# EAGLE design webcam (EAGLE 8.6.1)
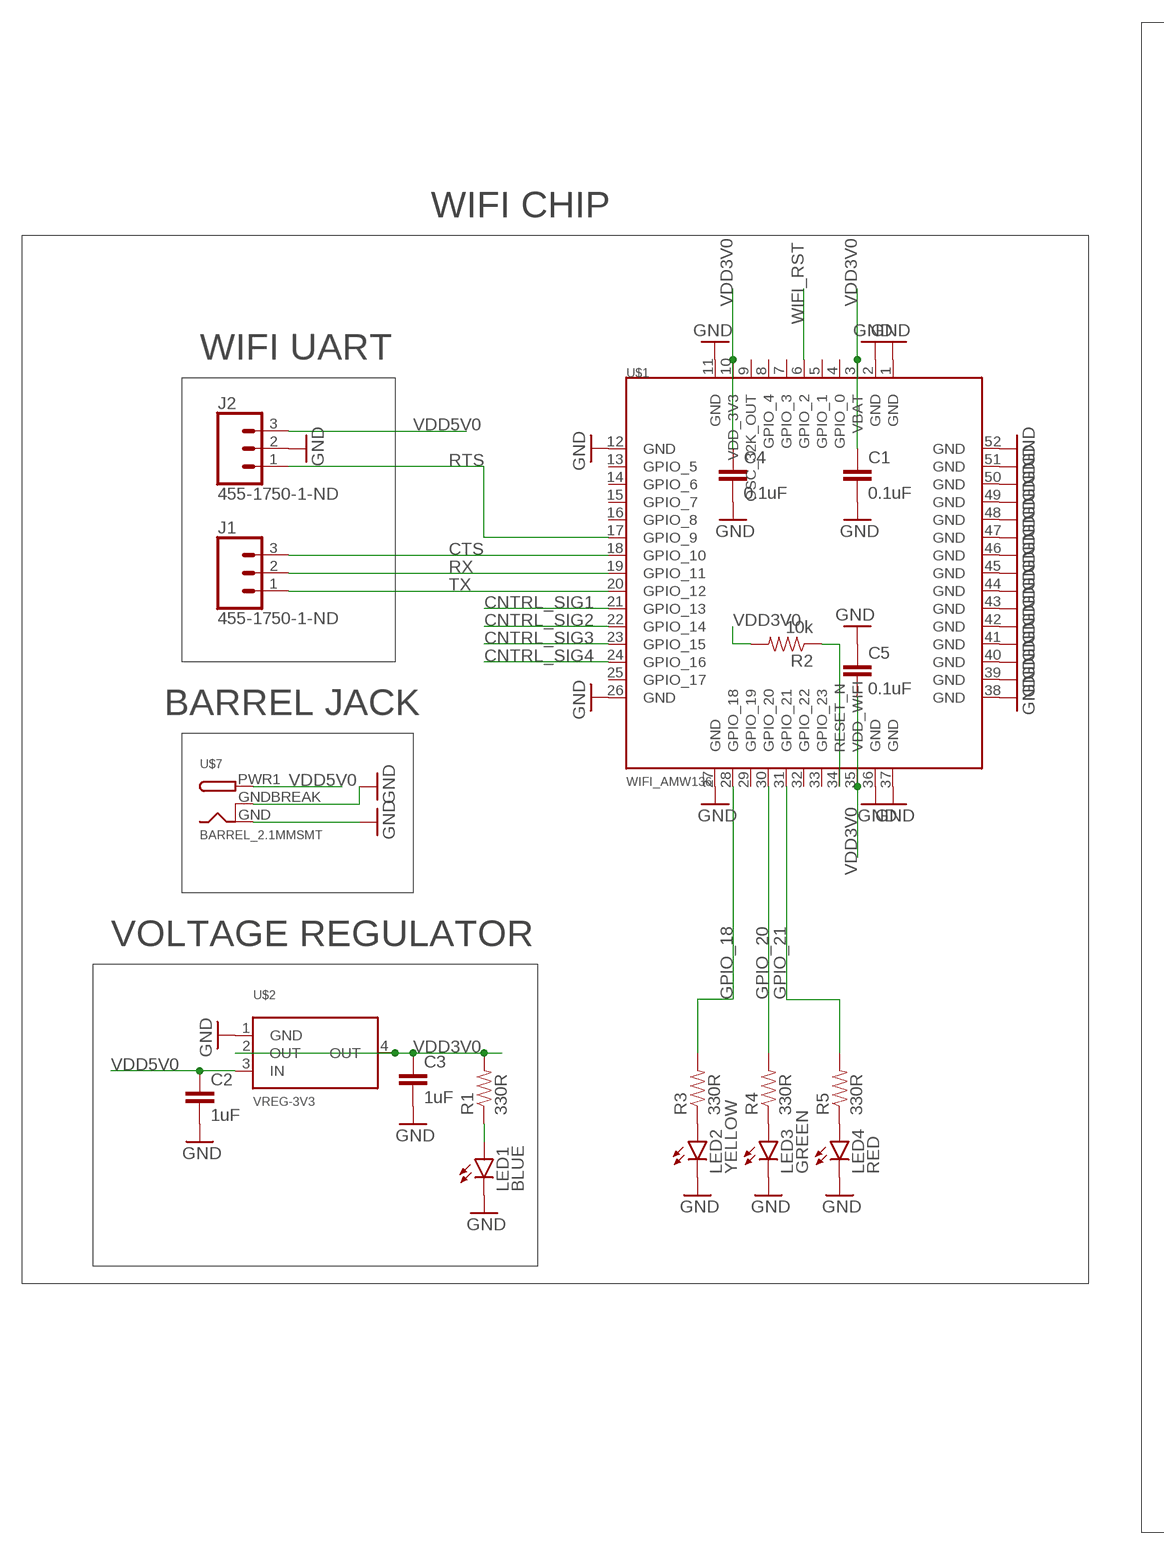
[diagram p0: schematic, sheet 1, part 1 of 2]
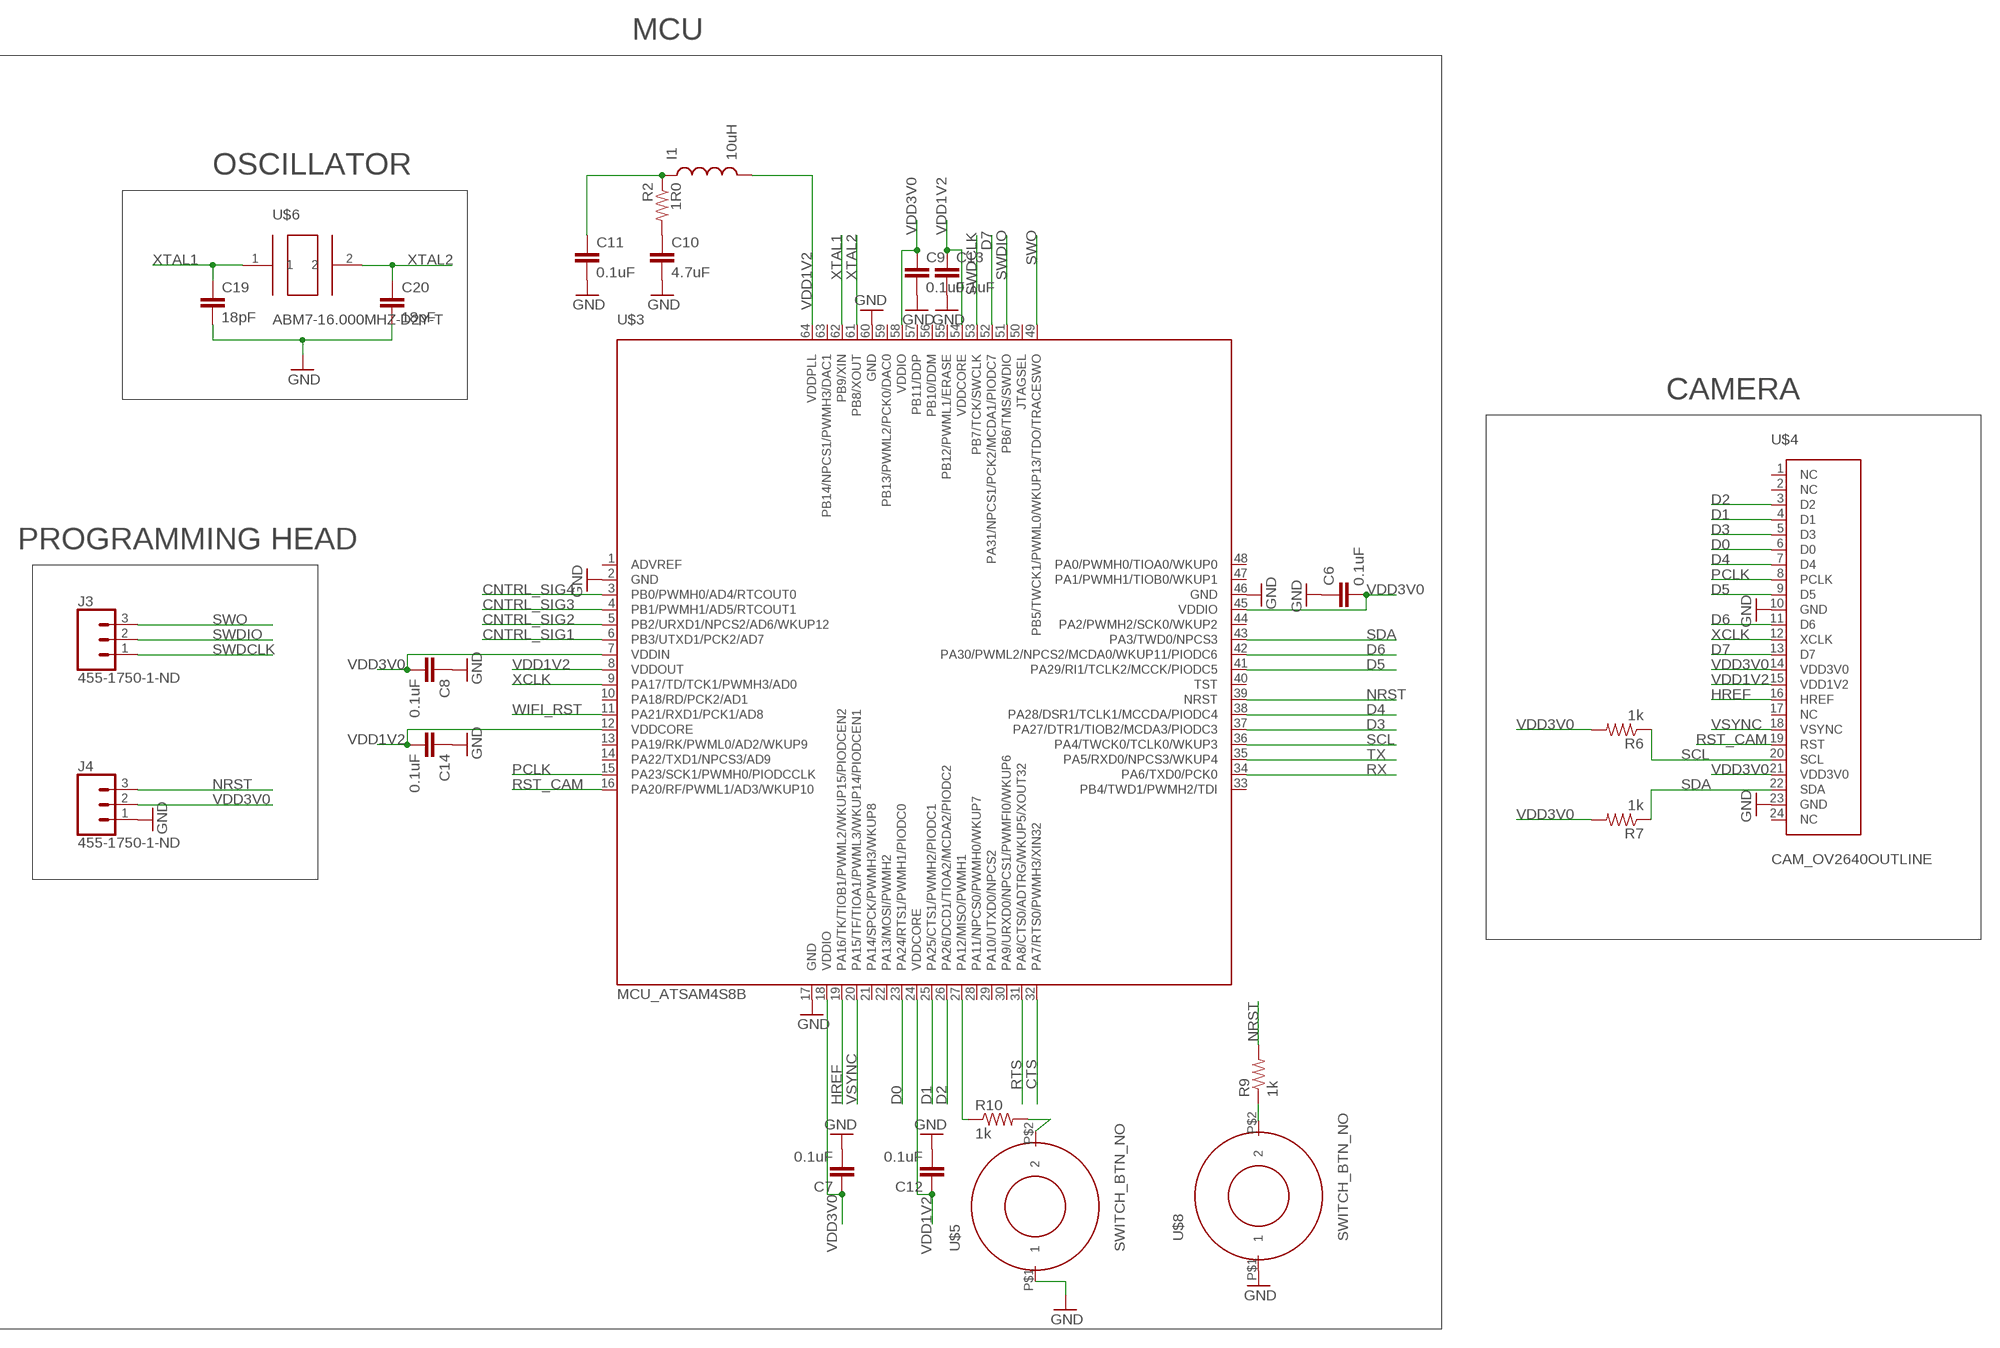
[diagram p1: schematic, sheet 1, part 2 of 2]

## Parts
1R0  R2  RES  [0805]
C1  0.1uF  CAP  [0805]
C2  1uF  CAP  [0805]
C3  1uF  CAP  [0805]
C4  0.1uF  CAP  [0805]
C5  0.1uF  CAP  [0805]
C6  0.1uF  CAP  [0805]
C7  0.1uF  CAP  [0805]
C8  0.1uF  CAP  [0805]
C9  0.1uF  CAP  [0805]
C10  4.7uF  CAP  [0805]
C11  0.1uF  CAP  [0805]
C12  0.1uF  CAP  [0805]
C13  0.1uF  CAP  [0805]
C14  0.1uF  CAP  [0805]
C19  18pF  CAP0805  [0805]
C20  18pF  CAP0805  [0805]
I1  10uH  IND  [0805]
J1  455-1750-1-ND  CONN_03  [1X03]
J2  455-1750-1-ND  CONN_03  [1X03]
J3  455-1750-1-ND  CONN_03  [1X03]
J4  455-1750-1-ND  CONN_03  [1X03]
LED1  BLUE  LED0603  [LED-0603]
LED2  YELLOW  LED0603  [LED-0603]
LED3  GREEN  LED0603  [LED-0603]
LED4  RED  LED0603  [LED-0603]
R1  330R  RES  [0805]
R2  10k  RES  [0805]
R3  330R  RES  [0805]
R4  330R  RES  [0805]
R5  330R  RES  [0805]
R6  1k  RES  [0805]
R7  1k  RES  [0805]
R9  1k  RES  [0805]
R10  1k  RES  [0805]
U$1  WIFI_AMW136  [AMW136]
U$2  VREG-3V3  [R-PDSO-G4_TI]
U$3  MCU_ATSAM4S8B  [QFP50P1200X1200X160-64N]
U$4  CAM_OV2640OUTLINE  [CAM_CONN]
U$5  SWITCH_BTN_NO  [BTN_2]
U$6  ABM7-16.000MHZ-D2Y-T  [ABM7-16.000MHZ-D2Y-T]
U$7  BARREL_2.1MMSMT  [DCJACK_2MM_SMT]
U$8  SWITCH_BTN_NO  [BTN_2]

## Nets
CNTRL_SIG1: U$1.21(GPIO_13) U$3.6(PB3/UTXD1/PCK2/AD7)
CNTRL_SIG2: U$1.22(GPIO_14) U$3.5(PB2/URXD1/NPCS2/AD6/WKUP12)
CNTRL_SIG3: U$1.23(GPIO_15) U$3.4(PB1/PWMH1/AD5/RTCOUT1)
CNTRL_SIG4: U$1.24(GPIO_16) U$3.3(PB0/PWMH0/AD4/RTCOUT0)
CTS: J1.3 U$1.18(GPIO_10) U$3.32(PA7/RTS0/PWMH3/XIN32)
D0: U$3.23(PA24/RTS1/PWMH1/PIODC0) U$4.6(D0)
D1: U$3.25(PA25/CTS1/PWMH2/PIODC1) U$4.4(D1)
D2: U$3.26(PA26/DCD1/TIOA2/MCDA2/PIODC2) U$4.3(D2)
D3: U$3.37(PA27/DTR1/TIOB2/MCDA3/PIODC3) U$4.5(D3)
D4: U$3.38(PA28/DSR1/TCLK1/MCCDA/PIODC4) U$4.7(D4)
D5: U$3.41(PA29/RI1/TCLK2/MCCK/PIODC5) U$4.9(D5)
D6: U$3.42(PA30/PWML2/NPCS2/MCDA0/WKUP11/PIODC6) U$4.11(D6)
D7: U$3.52(PA31/NPCS1/PCK2/MCDA1/PIODC7) U$4.13(D7)
GND: C1.2 C2.2 C3.2 C4.2 C5.1 C6.1 C7.2 C8.1 C9.2 C10.2 C11.2 C12.2 C13.2 C14.1 C19.2 C20.2 J2.2 J4.1 LED1.C LED2.C LED3.C LED4.C U$1.1(GND) U$1.2(GND) U$1.11(GND) U$1.12(GND) U$1.26(GND) U$1.27(GND) U$1.36(GND) U$1.37(GND) U$1.38(GND) U$1.39(GND) U$1.40(GND) U$1.41(GND) U$1.42(GND) U$1.43(GND) U$1.44(GND) U$1.45(GND) U$1.46(GND) U$1.47(GND) U$1.48(GND) U$1.49(GND) U$1.50(GND) U$1.51(GND) U$1.52(GND) U$2.1(GND) U$3.2(GND) U$3.17(GND) U$3.46(GND) U$3.60(GND) U$4.10(GND) U$4.23(GND) U$5.P$1 U$7.GND U$7.GNDBREAK U$8.P$1
GPIO_18: R3.2 U$1.28(GPIO_18)
GPIO_20: R4.2 U$1.30(GPIO_20)
GPIO_21: R5.2 U$1.31(GPIO_21)
HREF: U$3.19(PA16/TK/TIOB1/PWML2/WKUP15/PIODCEN2) U$4.16(HREF)
N$1: LED1.A R1.1
N$2: 1R0.2 C10.1
N$3: 1R0.1 C11.1 I1.1
N$6: R10.1 U$3.27(PA12/MISO/PWMH1)
N$7: R10.2 U$5.P$2
N$8: R9.1 U$8.P$2
N$13: LED2.A R3.1
N$14: LED3.A R4.1
N$15: LED4.A R5.1
N$21: R2.1 U$1.34(RESET_N)
NRST: J4.3 R9.2 U$3.39(NRST)
PCLK: U$3.15(PA23/SCK1/PWMH0/PIODCCLK) U$4.8(PCLK)
RST_CAM: U$3.16(PA20/RF/PWML1/AD3/WKUP10) U$4.19(RST)
RTS: J2.1 U$1.17(GPIO_9) U$3.31(PA8/CTS0/ADTRG/WKUP5/XOUT32)
RX: J1.2 U$1.19(GPIO_11) U$3.34(PA6/TXD0/PCK0)
SCL: R6.1 U$3.36(PA4/TWCK0/TCLK0/WKUP3) U$4.20(SCL)
SDA: R7.1 U$3.43(PA3/TWD0/NPCS3) U$4.22(SDA)
SWDCLK: J3.1 U$3.53(PB7/TCK/SWCLK)
SWDIO: J3.2 U$3.51(PB6/TMS/SWDIO)
SWO: J3.3 U$3.49(PB5/TWCK1/PWML0/WKUP13/TDO/TRACESWO)
TX: J1.1 U$1.20(GPIO_12) U$3.35(PA5/RXD0/NPCS3/WKUP4)
VDD1V2: C12.1 C13.1 C14.2 I1.2 U$3.8(VDDOUT) U$3.12(VDDCORE) U$3.24(VDDCORE) U$3.54(VDDCORE) U$3.64(VDDPLL) U$4.15(VDD1V2)
VDD3V0: C1.1 C3.1 C4.1 C5.2 C6.2 C7.1 C8.2 C9.1 J4.2 R1.2 R2.2 R6.2 R7.2 U$1.3(VBAT) U$1.10(VDD_3V3) U$1.35(VDD_WIFI) U$2.2(OUT) U$2.4(OUT) U$3.7(VDDIN) U$3.18(VDDIO) U$3.45(VDDIO) U$3.58(VDDIO) U$4.14(VDD3V0) U$4.21(VDD3V0)
VDD5V0: C2.1 J2.3 U$2.3(IN) U$7.PWR1(PWR)
VSYNC: U$3.20(PA15/TF/TIOA1/PWML3/WKUP14/PIODCEN1) U$4.18(VSYNC)
WIFI_RST: U$1.6(GPIO_2) U$3.11(PA21/RXD1/PCK1/AD8)
XCLK: U$3.9(PA17/TD/TCK1/PWMH3/AD0) U$4.12(XCLK)
XTAL1: C19.1 U$3.62(PB9/XIN) U$6.1
XTAL2: C20.1 U$3.61(PB8/XOUT) U$6.2
Unconnected: U$1.4(GPIO_0) U$1.5(GPIO_1) U$1.7(GPIO_3) U$1.8(GPIO_4) U$1.9(OSC_32K_OUT) U$1.13(GPIO_5) U$1.14(GPIO_6) U$1.15(GPIO_7) U$1.16(GPIO_8) U$1.25(GPIO_17) U$1.29(GPIO_19) U$1.32(GPIO_22) U$1.33(GPIO_23) U$3.1(ADVREF) U$3.10(PA18/RD/PCK2/AD1) U$3.13(PA19/RK/PWML0/AD2/WKUP9) U$3.14(PA22/TXD1/NPCS3/AD9) U$3.21(PA14/SPCK/PWMH3/WKUP8) U$3.22(PA13/MOSI/PWMH2) U$3.28(PA11/NPCS0/PWMH0/WKUP7) U$3.29(PA10/UTXD0/NPCS2) U$3.30(PA9/URXD0/NPCS1/PWMFI0/WKUP6) U$3.33(PB4/TWD1/PWMH2/TDI) U$3.40(TST) U$3.44(PA2/PWMH2/SCK0/WKUP2) U$3.47(PA1/PWMH1/TIOB0/WKUP1) U$3.48(PA0/PWMH0/TIOA0/WKUP0) U$3.50(JTAGSEL) U$3.55(PB12/PWML1/ERASE) U$3.56(PB10/DDM) U$3.57(PB11/DDP) U$3.59(PB13/PWML2/PCK0/DAC0) U$3.63(PB14/NPCS1/PWMH3/DAC1) U$4.1(NC) U$4.2(NC) U$4.17(NC) U$4.24(NC)

## Notes on the sheet
- MCU
- OSCILLATOR
- WIFI CHIP
- WIFI UART
- CAMERA
- PROGRAMMING HEAD
- BARREL JACK
- VOLTAGE REGULATOR

## Library data of the parts
1R0 R1-R7 R9 R10 = Ilya_Teach:RES
C1-C14 = Ilya_Teach:CAP
C19 C20 = SparkFun:CAP: Capacitor Standard 0603 ceramic capacitor, and 0.1" leaded capacitor.
I1 = Ilya_Teach:IND; SPICEPREFIX: I
J1-J4 = SparkFun-Connectors:CONN_03: Multi connection point. Often used as Generic Header-pin footprint for 0.1 inch spaced/style header connections On any of the 0.1 inch spaced packages, you can populate with these: Break Away Headers - Straight <https://www.sparkfun.com/products/116> (PRT-00116) Break Away Male Headers - Right Angle <https://www.sparkfun.com/products/553> (PRT-00553) Female Headers <https://www.sparkfun.com/products/115> (PRT-00115) Break Away Headers - Machine Pin <https://www.sparkfun.com/products/117> (PRT-00117) Break Away Female Headers - Swiss Machine Pin <https://www.sparkfun.com/products/743> (PRT-00743) Stackable Header - 3 Pin (Female, 0.1") <https://www.sparkfun.com/products/13875> (PRT-13875) For SCREWTERMINALS and SPRING TERMINALS visit here: Screw Terimnals on SparkFun.com <https://www.sparkfun.com/search/results?term=Screw+Terminals> (5mm/3.5mm/2.54mm spacing) This device is also useful as a general connection point to wire up your design to another part of your project. Our various solder wires solder well into these plated through hole pads. Hook-Up Wire - Assortment (Stranded, 22 AWG) <https://www.sparkfun.com/products/11375> (PRT-11375) Hook-Up Wire - Assortment (Solid Core, 22 AWG) <https://www.sparkfun.com/products/11367> (PRT-11367) View the entire wire category on our website here <https://www.sparkfun.com/categories/141> Special notes: Molex polarized connector foot print use with SKU : PRT-08232 with associated crimp pins and housings.; PROD_ID: XXX-00000
LED1-LED4 = Ilya_Teach:LED: LEDs Standard schematic elements and footprints for 5mm, 3mm, 1206, and 0603 sized LEDs. 5mm - Spark Fun Electronics SKU : COM-00529 (and others)
U$1 = Ilya_Teach:WIFI_AMW136
U$2 = Ilya_Teach:VREG-3V3
U$3 = Ilya_Teach:MCU_ATSAM4S8B
U$4 = Ilya_Teach:CAM_OV2640
U$5 U$8 = Ilya_Teach:SWITCH_BTN_NO
U$6 = Ilya:ABM7-16.000MHZ-D2Y-T
U$7 = Ilya_Teach:BARREL_2.1MM

## Board
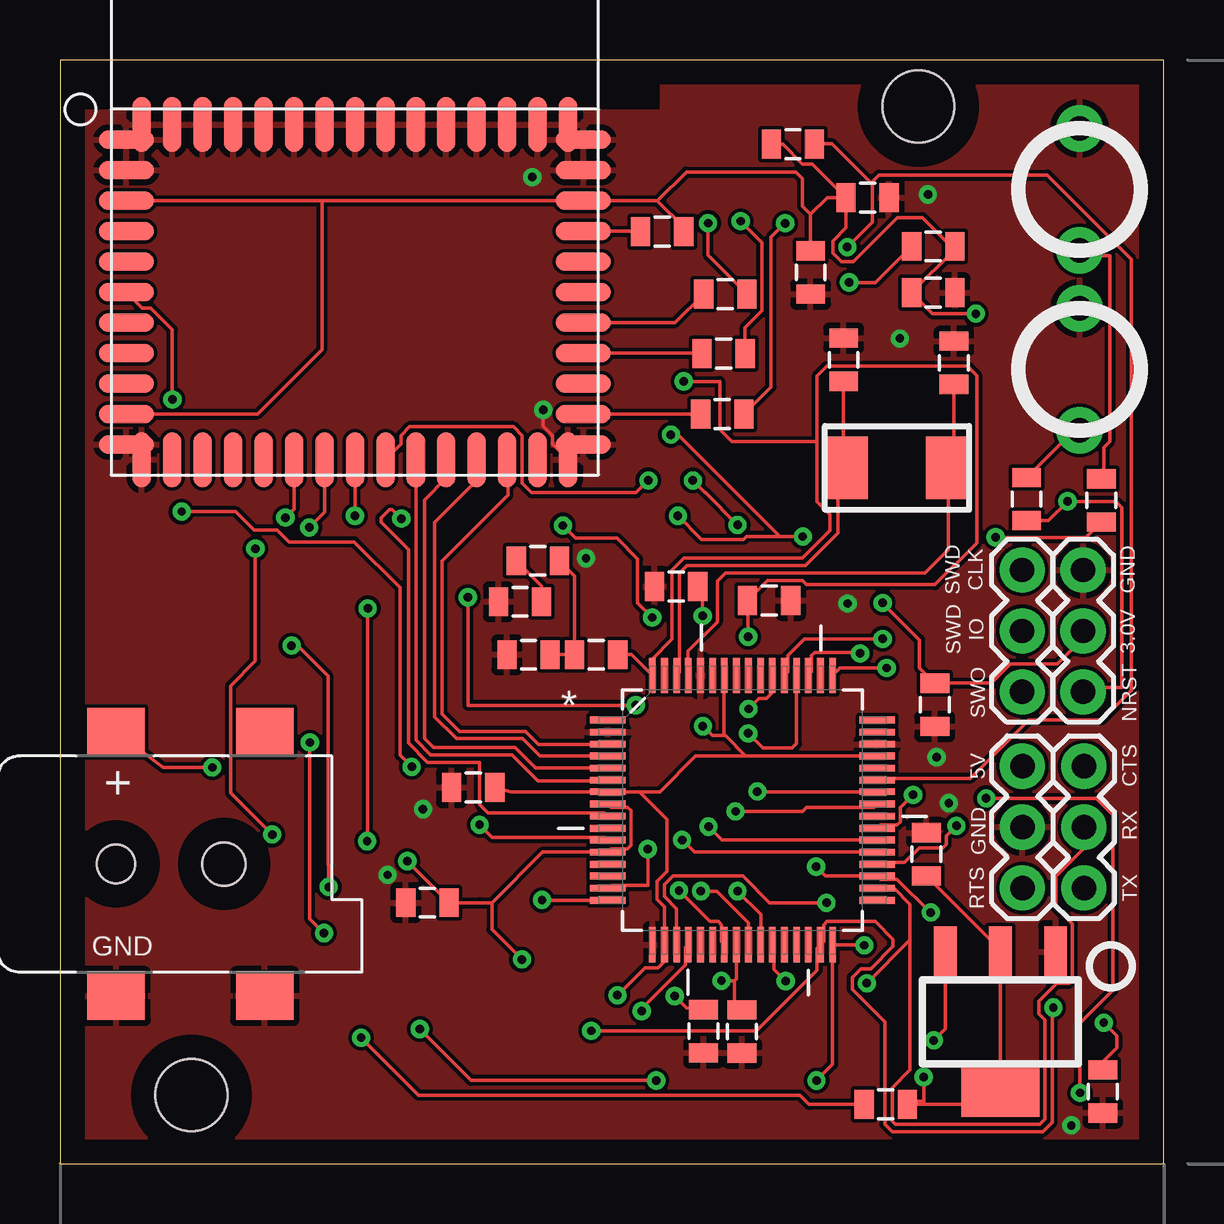
[diagram p2: board, top side]
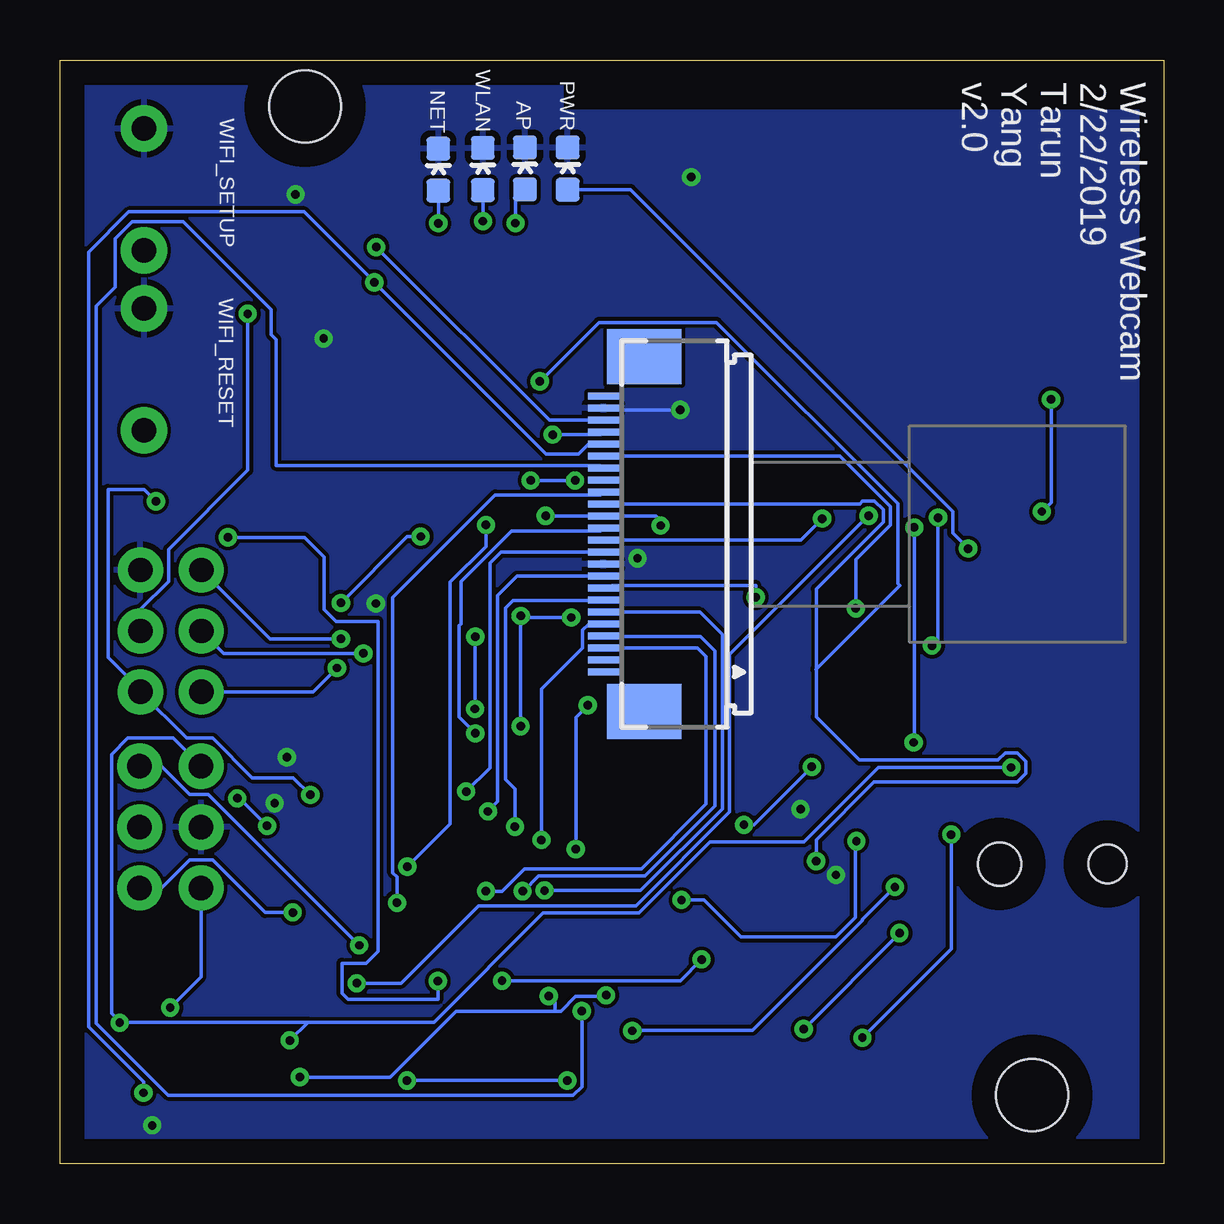
[diagram p3: board, bottom side, seen from below]

Size 46 x 46 mm. Coordinates in mm from the lower left corner, seen from the top.
Outline: 0,0 46,0 46,46 0,46 0,0
Copper layers (1*16): Top 0.035mm / dielectric 1.5mm / Bottom 0.035mm
Design rules "default": minimum track width 6mil, minimum drill 0.35mm, track to track 6mil, track to pad 6mil, pad to pad 6mil, via to via 6mil, smd to smd 6mil, copper to edge 40mil, drill to drill 6mil, minimum pad ring 10mil, minimum via ring 8mil, stop-mask expansion 4mil, vias tented up to drill 0mil, thermal gap 10mil
Holes 3 mm at 5.48,2.85 35.78,44.06

### Footprints (pad centres in the part's own frame; a part is rotated, then mirrored left to right if it is on the bottom)
0805 = smd 0.8 x 1.2: 1 -0.9,0; 2 0.9,0
1X03 = drill 1.016 pad 1.88: 1 0,0; 2 2.54,0; 3 5.08,0
LED-0603 = smd 1 x 1: A 0,-0.877; C 0,0.877
AMW136 = smd 0.762 x 2.286: 1 6.35,9.525; 2 5.08,9.525; 3 3.81,9.525; 4 2.54,9.525; 5 1.27,9.525; 6 0,9.525; 7 -1.27,9.525; 8 -2.54,9.525; 9 -3.81,9.525; 10 -5.08,9.525; 11 -6.35,9.525; 27 -6.35,-9.525; 28 -5.08,-9.525; 29 -3.81,-9.525; 30 -2.54,-9.525; 31 -1.27,-9.525; 32 0,-9.525; 33 1.27,-9.525; 34 2.54,-9.525; 35 3.81,-9.525; 36 5.08,-9.525; 37 6.35,-9.525 | smd 2.286 x 0.762: 12 -6.985,8.89; 13 -6.985,7.62; 14 -6.985,6.35; 15 -6.985,5.08; 16 -6.985,3.81; 17 -6.985,2.54; 18 -6.985,1.27; 19 -6.985,0; 20 -6.985,-1.27; 21 -6.985,-2.54; 22 -6.985,-3.81; 23 -6.985,-5.08; 24 -6.985,-6.35; 25 -6.985,-7.62; 26 -6.985,-8.89; 38 6.985,-8.89; 39 6.985,-7.62; 40 6.985,-6.35; 41 6.985,-5.08; 42 6.985,-3.81; 43 6.985,-2.54; 44 6.985,-1.27; 45 6.985,0; 46 6.985,1.27; 47 6.985,2.54; 48 6.985,3.81; 49 6.985,5.08; 50 6.985,6.35; 51 6.985,7.62; 52 6.985,8.89
R-PDSO-G4_TI = smd 0.95 x 2.15: 1 -2.3,-2.9; 2 0,-2.9; 3 2.3,-2.9 | smd 3.25 x 2.15: 4 0,2.9
QFP50P1200X1200X160-64N = smd 1.473 x 0.279: 1 -5.613,3.759; 2 -5.613,3.251; 3 -5.613,2.743; 4 -5.613,2.261; 5 -5.613,1.753; 6 -5.613,1.245; 7 -5.613,0.762; 8 -5.613,0.254; 9 -5.613,-0.254; 10 -5.613,-0.762; 11 -5.613,-1.245; 12 -5.613,-1.753; 13 -5.613,-2.261; 14 -5.613,-2.743; 15 -5.613,-3.251; 16 -5.613,-3.759; 33 5.613,-3.759; 34 5.613,-3.251; 35 5.613,-2.743; 36 5.613,-2.261; 37 5.613,-1.753; 38 5.613,-1.245; 39 5.613,-0.762; 40 5.613,-0.254; 41 5.613,0.254; 42 5.613,0.762; 43 5.613,1.245; 44 5.613,1.753; 45 5.613,2.261; 46 5.613,2.743; 47 5.613,3.251; 48 5.613,3.759 | smd 0.279 x 1.473: 17 -3.759,-5.613; 18 -3.251,-5.613; 19 -2.743,-5.613; 20 -2.261,-5.613; 21 -1.753,-5.613; 22 -1.245,-5.613; 23 -0.762,-5.613; 24 -0.254,-5.613; 25 0.254,-5.613; 26 0.762,-5.613; 27 1.245,-5.613; 28 1.753,-5.613; 29 2.261,-5.613; 30 2.743,-5.613; 31 3.251,-5.613; 32 3.759,-5.613; 49 3.759,5.613; 50 3.251,5.613; 51 2.743,5.613; 52 2.261,5.613; 53 1.753,5.613; 54 1.245,5.613; 55 0.762,5.613; 56 0.254,5.613; 57 -0.254,5.613; 58 -0.762,5.613; 59 -1.245,5.613; 60 -1.753,5.613; 61 -2.261,5.613; 62 -2.743,5.613; 63 -3.251,5.613; 64 -3.759,5.613
CAM_CONN = smd 0.3 x 1.3: 1 -5.75,3.25; 2 -5.25,3.25; 3 -4.75,3.25; 4 -4.25,3.25; 5 -3.75,3.25; 6 -3.25,3.25; 7 -2.75,3.25; 8 -2.25,3.25; 9 -1.75,3.25; 10 -1.25,3.25; 11 -0.75,3.25; 12 -0.25,3.25; 13 0.25,3.25; 14 0.75,3.25; 15 1.25,3.25; 16 1.75,3.25; 17 2.25,3.25; 18 2.75,3.25; 19 3.25,3.25; 20 3.75,3.25; 21 4.25,3.25; 22 4.75,3.25; 23 5.25,3.25; 24 5.75,3.25 | smd 2.3 x 3.1: P1 -7.4,1.55; P2 7.4,1.55
BTN_2 = drill 1.016 pad 1.93: P$1 -2.54,0; P$2 2.54,0
ABM7-16.000MHZ-D2Y-T = smd 1.9 x 2.6: 1 -2.15,0; 2 2.15,0
DCJACK_2MM_SMT = smd 2.4 x 2: GND -2.54,-5.5; GNDBREAK 3.66,-5.5; PWR1 -2.54,5.5; PWR2 3.66,5.5 | hole 1.6: -2.54,0 | hole 1.8: 1.96,0

### Placement (x,y rotation side)
1R0  19.92,25.13 180 top
C1  36.46,19.12 270 top
C2  43.46,3.01 270 top
C3  26.82,5.51 270 top
C4  17.22,15.67 180 top
C5  31.29,37.14 90 top
C6  25.68,24.05 0 top
C7  36.12,12.89 90 top
C8  36.4,36.3 180 top
C9  33.66,40.26 0 top
C10  19.18,23.42 180 top
C11  19.53,21.21 180 top
C12  28.43,5.51 270 top
C13  15.32,10.87 180 top
C14  29.56,23.47 180 top
C19  32.66,33.5 90 top
C20  37.26,33.38 90 top
I1  22.35,21.21 0 top
J1  42.68,11.48 90 top
J2  40.12,11.48 90 top
J3  40.11,24.74 270 top
J4  42.65,24.74 270 top
LED1  24.84,41.47 0 bottom
LED2  30.23,41.43 0 bottom
LED3  28.37,41.45 0 bottom
LED4  26.62,41.48 0 bottom
R1  34.42,2.46 0 top
R2  25.1,38.85 0 top
R3  27.61,31.24 180 top
R4  27.66,33.76 180 top
R5  27.74,36.25 180 top
R6  36.4,38.23 0 top
R7  30.55,42.49 180 top
R9  40.29,27.7 270 top
R10  43.41,27.64 90 top
U$1  12.29,36.32 90 top
U$2  39.2,5.91 180 top
U$3  28.45,14.73 0 top
U$4  20.09,26.24 90 bottom
U$5  42.5,40.6 270 top
U$6  34.89,29 0 top
U$7  4.87,12.48 0 top
U$8  42.5,33.1 270 top

### Tracks (layer width: path | path; a pad name or v marks a point on that pad's centre or on a via)
CNTRL_SIG1
  Top 0.152: U$3.6 22.81,15.95 19.93,15.95 18.84,17.03 15.45,17.03 14.83,17.65 U$1.21
CNTRL_SIG2
  Top 0.152: U$1.22 16.1,28.57 15.19,27.66 15.19,17.73 15.58,17.34 18.97,17.34 19.82,16.48 U$3.5
CNTRL_SIG3
  Top 0.152: U$3.4 20,16.99 19.29,17.71 16.53,17.71 15.62,18.62 15.62,26.72 17.37,28.47 U$1.23
CNTRL_SIG4
  Top 0.152: U$3.3 19.95,17.48 19.41,18.01 16.66,18.01 15.93,18.74 15.93,25.12 18.67,27.86 18.67,29.31 U$1.24
CTS  (via drill 0.35)
  Top 0.152: U$1.18 11.02,27.15 v10.39,26.52 | v33.53,9.09 33.5,9.12 U$3.32 32.21,4.13 v31.54,3.46 | v15,5.6 17.14,3.46 v24.86,3.46 | v11.01,9.6 10.41,10.2 v10.41,17.55
  Bottom 0.152: v10.39,26.52 10.39,17.58 v10.41,17.55 | v33.53,9.09 39.83,15.39 40.6,15.39 41.77,16.56 J1.3 | v31.54,3.46 v24.86,3.46 | v15,5.6 v11.01,9.6
D0  (via drill 0.35)
  Top 0.152: U$3.23 27.57,9.23 27.57,9.95 27.44,10.08 27.1,10.08 v25.8,11.38
  Bottom 0.152: v25.8,11.38 21.79,11.38 18.39,14.78 18.39,22.05 19.33,22.99 U$4.6
D1  (via drill 0.35)
  Top 0.152: U$3.25 28.7,10.03 27.38,11.35 v26.71,11.35
  Bottom 0.152: v26.71,11.35 26.69,11.35 26.05,11.99 21.62,11.99 18.69,14.91 18.69,21.36 19.3,21.97 23.32,21.97 U$4.4
D2  (via drill 0.35)
  Top 0.152: U$3.26 29.21,10.38 v28.24,11.35
  Bottom 0.152: v28.24,11.35 27.57,11.35 26.63,12.29 21.77,12.29 19.07,14.99 19.07,21.13 19.43,21.49 U$4.3 | U$4.3
D3  (via drill 0.35)
  Top 0.152: U$3.37 26.44,12.98 v25.93,13.49
  Bottom 0.152: U$4.5 23.35,22.48 23.97,22.48 24.22,22.23 24.22,21.5 25.93,19.79 v25.93,13.49
D4  (via drill 0.35)
  Top 0.152: U$3.38 27.59,13.49 v27.04,14.04
  Bottom 0.152: U$4.7 23.36,23.47 27.11,23.47 27.43,23.15 27.43,22.09 27.43,16.02 27.03,15.61 v27.03,14.05 v27.04,14.04
D5  (via drill 0.35)
  Top 0.152: U$3.41 33.92,14.85 31.12,14.85 30.96,14.68 v28.17,14.68 v28.16,14.68
  Bottom 0.152: U$4.9 26.95,24.49 27.75,23.68 27.75,15.09 v28.16,14.68
D6  (via drill 0.35)
  Top 0.152: U$3.42 v29.08,15.49 v29.07,15.51
  Bottom 0.152: U$4.11 27.62,25.49 28.08,25.03 28.08,16.5 v29.07,15.51
D7  (via drill 0.35)
  Top 0.152: v28.68,17.93 29.29,17.32 30.52,17.32 30.71,17.51 U$3.52
  Bottom 0.152: U$4.13 23.46,26.37 27.18,26.37 29.29,24.25 29.29,22.5 29.36,22.43 29.36,18.61 v28.68,17.93
GND  (via drill 0.35)
  Top 0.152: U$1.11 3,29.85 3.5,29.35 U$1.12 | U$1.52 3.25,43.1 3,42.85 U$1.1 | U$1.38 21.25,43.1 21.5,42.85 21.75,42.85 U$1.37 | U$1.27 U$1.26 20.52,30 20.52,30.35 20.14,30.73 v20.14,31.42
  Bottom 0.152: v20.14,31.42 23.27,31.42 U$4.23
  other vias: 13.66,12.03 15.13,14.77 32.84,23.34 36.54,16.94 19.69,41.12 21.93,25.23 37.05,15.02 35.01,34.39 42.16,1.59 36.18,40.39
  pour Top: -0.68,-0.94 47.42,-0.94 47.42,46.03 -0.68,46.03
  pour Bottom: -0.68,-0.94 47.5,-0.94 47.5,46.03 -0.68,46.03
GPIO_18
  Top 0.152: U$1.28 R3.2
GPIO_20
  Top 0.152: U$1.30 26.73,33.78 R4.2
GPIO_21
  Top 0.152: U$1.31 25.64,35.05 R5.2
HREF  (via drill 0.35)
  Top 0.152: v31.95,10.87 29.58,10.87 28.46,11.99 25.55,11.99 25.2,11.63 25.2,11.13 25.7,10.62 U$3.19
  Bottom 0.152: v31.95,10.87 31.95,11.95 32.13,12.12 32.13,23.59 27.86,27.87 23.46,27.87 U$4.16
N$1  (via drill 0.35)
  Top 0.152: R1.1 31.22,2.46 30.84,2.85 14.95,2.85 v12.55,5.25 | v8.14,25.63 8.14,20.94 7.11,19.9 7.11,15.46 v8.85,13.71
  Bottom 0.152: v8.14,25.63 8.79,26.28 8.79,27.18 22.21,40.6 LED1.A | v8.85,13.71 8.85,8.95 v12.55,5.25
N$2
  Top 0.152: 1R0.2 20.08,24.07 C10.1
N$3
  Top 0.152: C11.1 I1.1 21.45,24.5 1R0.1
N$6  (via drill 0.35)
  Top 0.152: v39,26.1 42.75,26.1 43.25,26.6 R10.1 | v30.25,7.6 29.75,8.1 29.75,9.1 U$3.27
  Bottom 0.152: v30.25,7.6 30.25,6.85 34,6.85 34.25,7.1 34.25,8.35 33.25,8.35 32.75,8.85 32.75,22.6 34.5,22.6 35,23.1 35,25.29 35.81,26.1 v39,26.1
N$7
  Top 0.152: R10.2 43.5,28.6 43.5,29.85 43.75,30.1 43.75,37.85 42.5,37.85 U$5.P$2
N$8
  Top 0.152: R9.1 42.26,30.56 U$8.P$2
N$13  (via drill 0.35)
  Top 0.152: R3.1 29.64,32.37 29.64,38.61 v30.23,39.19
  Bottom 0.152: v30.23,39.19 LED2.A
N$14  (via drill 0.35)
  Top 0.152: R4.1 28.56,34.85 29.27,35.55 29.27,38.39 v28.37,39.28
  Bottom 0.152: v28.37,39.28 LED3.A
N$15  (via drill 0.35)
  Top 0.152: R5.1 27.02,37.87 v27.02,39.2
  Bottom 0.152: v27.02,39.2 27.02,40.2 LED4.A
N$21
  Top 0.152: U$1.34 24.19,38.86 R2.1
NRST  (via drill 0.35)
  Top 0.152: U$3.39 34.2,14.11 34.89,14.11 35.03,14.24 35.03,14.83 v35.56,15.37 | J4.3 42.75,19.85 44.25,19.85 44.25,27.35 44,27.6 v42,27.6 41.19,26.8 R9.2
  Bottom 0.152: v35.56,15.37 36.27,16.08 37.98,16.08 39.63,17.73 40.72,17.73 J4.3 42.75,19.85 44,21.1 44,28.1 42.5,28.1 v42,27.6
PCLK  (via drill 0.35)
  Top 0.152: v17,23.6 17,19.1 v24,19.1 | v24.5,13.1 24.5,11.6 23,11.6 U$3.15
  Bottom 0.152: v17,23.6 17,24.1 23,24.1 U$4.8 | v24,19.1 24.5,18.6 v24.5,13.1
RST_CAM  (via drill 0.35)
  Top 0.152: v12.8,13.44 12.83,13.46 v12.83,23.14 | U$3.16 20.1,10.97 v20.09,10.98
  Bottom 0.152: v12.83,23.14 12.83,25.18 11.38,26.62 11.38,27.38 13.49,29.49 U$4.19 | v12.8,13.44 12.85,13.39 12.85,10.26 13.66,9.45 17.61,9.45 19.15,11 20.08,11 v20.09,10.98
RTS  (via drill 0.35)
  Top 0.152: U$1.17 9.75,27.28 v9.4,26.92 | v9.65,21.59 9.91,21.59 11.18,20.32 11.18,12.45 11.2,12.42 v11.2,11.52 | v22.15,5.53 29.04,5.53 31.56,8.05 31.56,8.98 U$3.31 31.84,9.26 31.84,9.95 31.97,10.08 33.98,10.08 34.72,9.35 34.72,9.04 33.8,8.12 33.38,8.12 33.02,7.77 33.02,7.26 34.38,5.9 34.38,1.64 34.7,1.33 40.97,1.33 41.36,1.72 41.36,6.46 v41.41,6.5
  Bottom 0.152: v9.4,26.92 9.4,21.84 v9.65,21.59 | v11.2,11.52 12.55,10.18 12.55,10.14 17.13,5.55 22.12,5.55 v22.15,5.53 | v41.41,6.5 40.12,7.79 J2.1
RX  (via drill 0.35)
  Top 0.152: U$3.34 34.75,11.48 35.43,10.8 35.43,9.32 | 35.43,9.32 35.43,3.9 34.69,3.16 34.69,1.77 34.82,1.63 40.85,1.63 41.06,1.85 41.06,5.99 40.8,6.25 40.8,6.75 41.56,7.51 42.07,7.51 42.21,7.64 42.21,9.98 41.52,10.68 41.52,11.97 42.68,13.13 J1.2 | 35.43,9.32 v33.63,7.52 | v12.29,27 U$1.19
  Bottom 0.152: v33.63,7.52 31.78,7.52 28.55,10.74 26.46,10.74 26.46,10.75 21.99,10.75 18.09,14.66 18.09,21.21 v12.29,27
SCL  (via drill 0.35)
  Top 0.152: R6.1 34,36.73 v32.89,36.73 | v42.52,2.95 42.52,5.84 43.89,7.21 43.89,14.53 43.2,15.22 v38.61,15.22 | U$3.36 34.14,12.55 35.2,12.55 35.82,13.16 36.81,13.16 36.95,13.3 36.95,13.66 v37.37,14.08
  Bottom 0.152: U$4.20 23.96,29.99 24.22,29.73 24.38,29.57 25.73,29.57 v32.89,36.73 32.92,36.78 35.81,39.67 43.13,39.67 44.81,38 44.81,5.69 42.52,3.4 v42.52,2.95 | v37.37,14.08 38.51,15.22 v38.61,15.22
SDA  (via drill 0.35)
  Top 0.152: v32.82,38.2 33.86,39.24 33.86,40.83 | 33.86,40.83 32.18,42.51 31.47,42.51 R7.1 | U$3.43 34.14,16.05 37.95,16.05 40.39,18.49 43.43,18.49 44.65,19.71 44.65,37.69 41.15,41.2 34.14,41.2 33.83,40.89 33.86,40.83
  Bottom 0.152: v32.82,38.2 25.6,30.99 U$4.22
SWDCLK  (via drill 0.35)
  Top 0.152: U$3.53 30.34,20.48 30.34,21.18 31.03,21.87 v34.29,21.87
  Bottom 0.152: v34.29,21.87 37.24,21.87 J3.1
SWDIO  (via drill 0.35)
  Top 0.152: U$3.51 31.33,20.48 31.33,21.18 31.46,21.31 33.31,21.31 v33.36,21.26
  Bottom 0.152: J3.2 39.17,21.26 v33.36,21.26
SWO  (via drill 0.35)
  Top 0.152: U$3.49 32.52,20.66 v34.46,20.66
  Bottom 0.152: J3.3 35.45,19.66 v34.46,20.66
TX  (via drill 0.35)
  Top 0.152: v36.3,10.46 36.28,10.46 34.89,11.85 34.2,11.85 U$3.35 31.91,11.99 v31.52,12.37 | U$1.20 14.22,30 14.22,30.35 14.58,30.71 18.9,30.71 19.25,30.35 19.25,28.38 19.66,27.97 24.02,27.97 v24.53,28.47 | v28.25,26.62 26.9,27.97 26.89,27.97 v26.38,28.47
  Bottom 0.152: v36.3,10.46 37.45,10.46 39.63,12.65 40.6,12.65 41.77,11.48 J1.1 | v28.25,26.62 28.25,25.73 29.74,24.23 29.74,14.15 v31.52,12.37 | v24.53,28.47 v26.38,28.47
VDD1V2  (via drill 0.35)
  Top 0.152: I1.2 23.82,21.21 U$3.64 24.69,21.04 25.51,21.86 25.51,24.74 26,25.23 30.95,25.23 32.1,26.38 32.1,27.06 31.56,27.6 31.56,30.1 | U$3.24 28.19,7.71 28.11,7.62 | v27.57,7.62 28.11,7.62 | 28.11,7.62 28.11,6.8 C12.1 | 18.01,10.87 17.5,10.87 C13.1 v14.48,12.61 | 31.56,30.1 31.56,32.82 31.97,33.23 37.83,33.23 38.21,32.85 38.21,25.87 36.47,24.13 31.12,24.13 30.95,24.3 29.49,24.3 C14.2 28.68,23.44 v28.68,21.96 | 31.56,30.1 28,30.1 27.5,30.6 27.5,32.6 v26,32.6 | 18.01,10.87 20.12,12.98 U$3.12 22.97,13.12 23.67,13.12 23.8,13.25 23.8,14.71 23.67,14.85 22.97,14.85 U$3.8 | 18.01,10.87 18.01,9.75 v19.26,8.51 | v28.7,18.95 29.13,19.38 29.44,19.38 29.69,19.63 U$3.54
  Bottom 0.152: v27.57,7.62 20.14,7.62 v19.26,8.51 | v14.48,12.61 14.48,13.49 12.07,15.9 6.1,15.9 5.74,16.26 5.74,16.76 6.1,17.12 6.6,17.12 6.9,16.82 12.67,16.82 14.48,18.62 14.48,20.6 | 14.48,20.6 14.48,23.96 11.69,26.75 11.69,27.25 12.04,27.61 12.54,27.61 12.66,27.49 U$4.15 | v26,32.6 23.54,35.06 18.63,35.06 11.08,27.5 11.08,24.18 11,24.1 14.5,20.6 14.48,20.6 | v28.7,18.95 28.7,21.94 v28.68,21.96
VDD3V0  (via drill 0.35)
  Top 0.152: U$3.58 27.69,17.88 27.73,17.83 | 27.73,17.83 28.57,16.99 | 28.57,16.99 U$3.45 | J4.2 42.65,21.89 41.58,20.83 39.62,20.83 38.82,20.02 C1.1 35.83,20.66 35.83,21.83 v34.29,23.37 | C5.2 31.29,39.57 | C9.1 31.98,40.26 31.29,39.57 | R6.2 37.3,38.09 | 37.3,38.09 37.3,38.08 35.94,39.43 34.91,39.43 33.07,37.59 32.56,37.59 32.21,37.95 32.21,38.45 32.76,39 C9.1 | 24.89,40.13 U$1.35 10.92,40.13 | 24.89,40.13 24.92,40.13 26.11,41.33 30.68,41.33 30.95,41.06 30.95,39.9 31.29,39.57 | U$1.3 10.92,40.13 | U$1.10 8.23,31.24 10.92,33.93 10.92,40.13 | v30.96,26.14 30,26.14 | 30,26.14 28.62,26.14 28.5,26.01 26.74,26.01 v25.76,27 | C4.1 18.81,15.49 U$3.7 24.16,15.49 | 30,26.14 25.75,30.38 v25.46,30.38 | R2.2 26,39.02 24.89,40.13 | v36,3.6 36,2.6 35.5,2.6 R1.2 38.65,2.46 U$2.4 U$2.2 39.2,8.94 39.17,8.94 C7.1 | v26.8,18.23 27.19,17.83 27.73,17.83 | v23.24,7.01 24.38,8.15 24.92,8.15 25.2,8.43 U$3.18 25.2,10.7 24.89,11 24.89,11.76 25.31,12.17 25.31,14.34 24.16,15.49 | C3.1 26.12,6.49 v25.62,6.98 | 24.16,15.49 24.17,15.49 25,15.49 26.5,16.99 28.57,16.99 | C9.1 31.36,41.66 30.96,41.66 30.13,42.49 R7.2 | 37.3,38.09 37.29,38.09 C8.2 36.37,35.42 v38.18,35.42 | C6.2 26.79,23.84 v26.79,22.83 | v24.69,22.76 24.08,23.37 24.08,25.2 23.21,26.06 21.5,26.06 v20.96,26.6
  Bottom 0.152: J4.2 42.65,23.09 41.48,24.26 41.48,25.6 38.18,28.9 v38.18,35.42 | v34.29,23.37 31.52,26.14 v30.96,26.14 | v25.76,27 25.74,26.99 U$4.14 21.16,26.99 21.15,27 20.96,26.81 v20.96,26.6 | v25.46,30.38 23.45,30.38 U$4.21 | v36,3.6 32.25,3.6 29.5,6.35 25.37,6.35 | v26.8,18.23 v26.79,18.23 26.79,22.14 v26.79,22.83 26.67,22.76 v24.69,22.76 | 25.37,6.35 25.11,6.35 24.5,6.96 23.29,6.96 v23.24,7.01 | v25.62,6.98 25.37,6.73 25.37,6.35
VDD5V0  (via drill 0.35)
  Top 0.152: U$2.3 36.9,5.61 v36.42,5.13 | U$7.PWR1 4.31,16.51 v6.35,16.51 | v43.51,5.87 44.05,5.33 44.05,4.83 43.47,4.24 C2.1
  Bottom 0.152: v36.42,5.13 35.66,5.89 | 35.66,5.89 30.41,5.89 25.86,10.44 21.87,10.44 18.9,13.41 14.99,13.41 11.89,16.51 v6.35,16.51 | J2.3 41.29,17.73 43.17,17.73 43.85,17.05 43.85,6.26 43.48,5.89 | 35.66,5.89 43.48,5.89 | 43.48,5.89 v43.51,5.87
VSYNC  (via drill 0.35)
  Top 0.152: U$3.20 26.07,9 26.07,8.29 24.25,6.46 v24.25,6.35
  Bottom 0.152: U$4.18 23.5,29.1 37,29.1 37,34.35 37.2,34.55 37.2,35.59 40.87,39.26 42.99,39.26 43.69,38.56 43.69,36.54 44.5,35.73 44.5,5.85 41.5,2.85 24.61,2.85 24.25,3.21 v24.25,6.35
WIFI_RST  (via drill 0.35)
  Top 0.152: U$3.11 22.72,13.6 18.01,13.6 v17.49,14.12 | v14.66,16.54 14.17,17.02 14.17,24 12.27,25.91 9.55,25.91 9.05,26.42 8.09,26.42 7.33,27.18 v5.07,27.18 | v4.69,31.85 4.69,34.76 3.78,35.66 3.43,35.66 U$1.6
  Bottom 0.152: v14.66,16.54 17.08,14.12 v17.49,14.12 | v5.07,27.18 4.69,27.56 v4.69,31.85
XCLK  (via drill 0.35)
  Top 0.152: U$3.9 22.7,14.62 17.85,14.62 17.49,14.98 17.49,16.73 15.33,16.73 14.53,17.53 14.53,25.6 13.38,26.75 13.38,26.91 13.73,27.26 13.85,27.26 v14.23,26.88
  Bottom 0.152: U$4.12 15.12,25.99 v14.23,26.88
XTAL1
  Top 0.152: C19.1 32.66,29.07 U$6.1 32.42,28.68 32.42,26.28 31.07,24.93 26.13,24.93 25.82,24.61 25.82,20.46 U$3.62
XTAL2
  Top 0.152: C20.1 37.26,29.22 U$6.2 37.04,25.6 36.05,24.62 27.73,24.62 27.4,24.29 27.4,22.57 26.19,21.37 U$3.61

### Text on the board
tPlace: SWD / CLK | GND | SWD / IO | 3.0V | SWO | NRST | 5V | CTS | GND | RX | RTS | TX
bPlace: Wireless Webcam / 2/22/2019 / Tarun / Yang / v2.0 | WLAN | PWR | AP | NET | WIFI_SETUP | WIFI_RESET